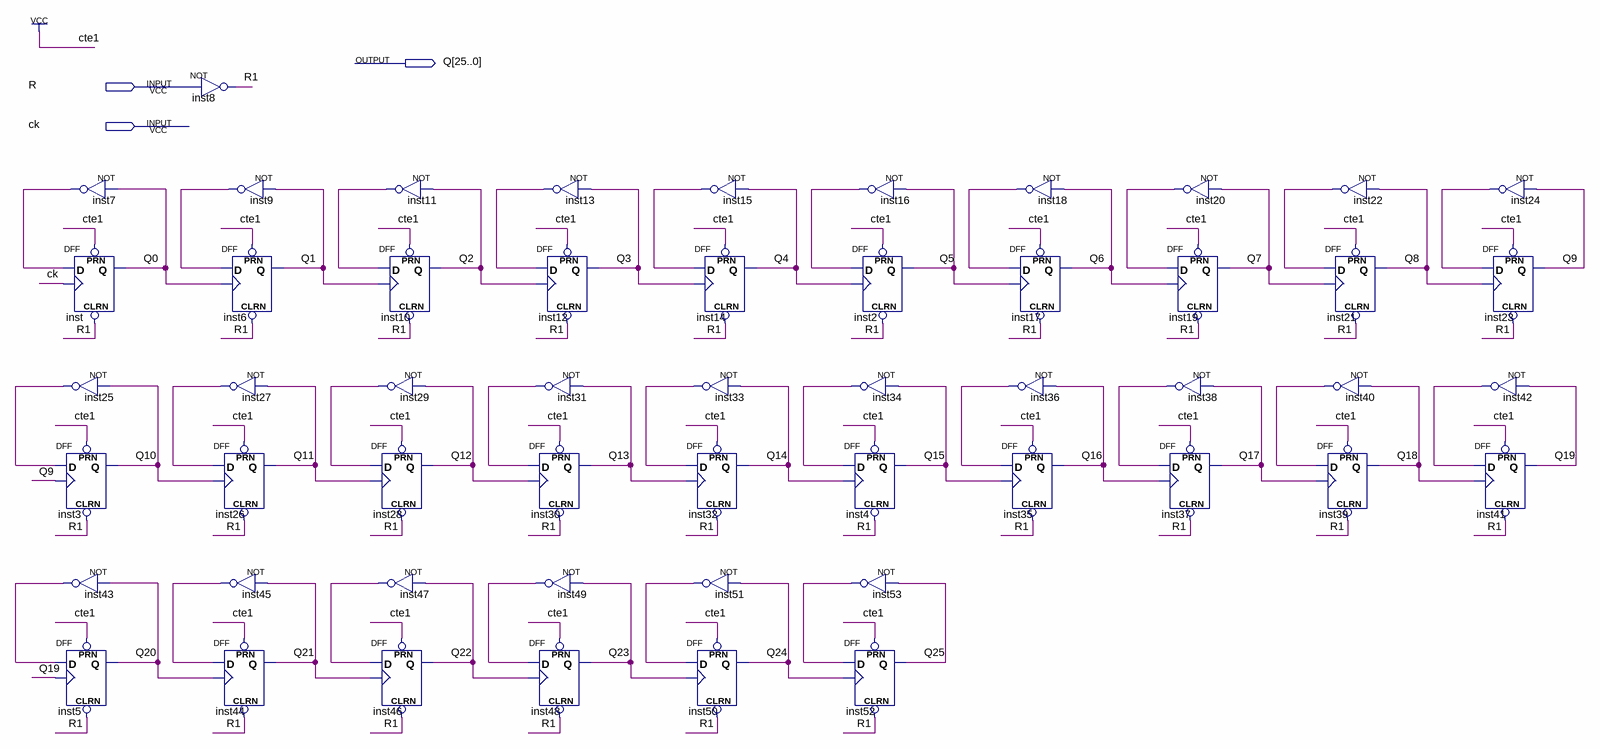
[diagram p0: schematic sheet]
// Quartus schematic DivFreq.bdf as structural Verilog: 53 symbols, 3 pins
module DivFreq (
  input  R,
  input  ck,
  output [25:0] Q
);

  wire inst7_out, inst9_out, inst11_out, inst13_out, inst15_out, inst16_out, inst18_out, inst20_out,
       inst22_out, inst24_out, inst25_out, inst27_out, inst29_out, inst31_out, inst33_out, inst34_out,
       inst36_out, inst38_out, inst40_out, inst42_out, inst43_out, inst45_out, inst47_out, inst49_out,
       inst51_out, inst53_out, R1;

  not inst7 (inst7_out, Q[0]);
  DFF inst (.CLRN(R1), .CLK(ck), .D(inst7_out), .PRN(1'b1), .Q(Q[0]));
  not inst25 (inst25_out, Q[10]);
  DFF inst3 (.CLRN(R1), .CLK(Q[9]), .D(inst25_out), .PRN(1'b1), .Q(Q[10]));
  not inst43 (inst43_out, Q[20]);
  DFF inst5 (.CLRN(R1), .CLK(Q[19]), .D(inst43_out), .PRN(1'b1), .Q(Q[20]));
  not inst8 (R1, R);
  not inst9 (inst9_out, Q[1]);
  DFF inst6 (.CLRN(R1), .CLK(Q[0]), .D(inst9_out), .PRN(1'b1), .Q(Q[1]));
  not inst27 (inst27_out, Q[11]);
  DFF inst26 (.CLRN(R1), .CLK(Q[10]), .D(inst27_out), .PRN(1'b1), .Q(Q[11]));
  not inst45 (inst45_out, Q[21]);
  DFF inst44 (.CLRN(R1), .CLK(Q[20]), .D(inst45_out), .PRN(1'b1), .Q(Q[21]));
  not inst11 (inst11_out, Q[2]);
  DFF inst10 (.CLRN(R1), .CLK(Q[1]), .D(inst11_out), .PRN(1'b1), .Q(Q[2]));
  not inst29 (inst29_out, Q[12]);
  DFF inst28 (.CLRN(R1), .CLK(Q[11]), .D(inst29_out), .PRN(1'b1), .Q(Q[12]));
  not inst47 (inst47_out, Q[22]);
  DFF inst46 (.CLRN(R1), .CLK(Q[21]), .D(inst47_out), .PRN(1'b1), .Q(Q[22]));
  not inst13 (inst13_out, Q[3]);
  DFF inst12 (.CLRN(R1), .CLK(Q[2]), .D(inst13_out), .PRN(1'b1), .Q(Q[3]));
  not inst31 (inst31_out, Q[13]);
  DFF inst30 (.CLRN(R1), .CLK(Q[12]), .D(inst31_out), .PRN(1'b1), .Q(Q[13]));
  not inst49 (inst49_out, Q[23]);
  DFF inst48 (.CLRN(R1), .CLK(Q[22]), .D(inst49_out), .PRN(1'b1), .Q(Q[23]));
  not inst15 (inst15_out, Q[4]);
  DFF inst14 (.CLRN(R1), .CLK(Q[3]), .D(inst15_out), .PRN(1'b1), .Q(Q[4]));
  not inst33 (inst33_out, Q[14]);
  DFF inst32 (.CLRN(R1), .CLK(Q[13]), .D(inst33_out), .PRN(1'b1), .Q(Q[14]));
  not inst51 (inst51_out, Q[24]);
  DFF inst50 (.CLRN(R1), .CLK(Q[23]), .D(inst51_out), .PRN(1'b1), .Q(Q[24]));
  not inst16 (inst16_out, Q[5]);
  DFF inst2 (.CLRN(R1), .CLK(Q[4]), .D(inst16_out), .PRN(1'b1), .Q(Q[5]));
  not inst34 (inst34_out, Q[15]);
  DFF inst4 (.CLRN(R1), .CLK(Q[14]), .D(inst34_out), .PRN(1'b1), .Q(Q[15]));
  not inst53 (inst53_out, Q[25]);
  DFF inst52 (.CLRN(R1), .CLK(Q[24]), .D(inst53_out), .PRN(1'b1), .Q(Q[25]));
  not inst18 (inst18_out, Q[6]);
  DFF inst17 (.CLRN(R1), .CLK(Q[5]), .D(inst18_out), .PRN(1'b1), .Q(Q[6]));
  not inst36 (inst36_out, Q[16]);
  DFF inst35 (.CLRN(R1), .CLK(Q[15]), .D(inst36_out), .PRN(1'b1), .Q(Q[16]));
  not inst20 (inst20_out, Q[7]);
  DFF inst19 (.CLRN(R1), .CLK(Q[6]), .D(inst20_out), .PRN(1'b1), .Q(Q[7]));
  not inst38 (inst38_out, Q[17]);
  DFF inst37 (.CLRN(R1), .CLK(Q[16]), .D(inst38_out), .PRN(1'b1), .Q(Q[17]));
  not inst22 (inst22_out, Q[8]);
  DFF inst21 (.CLRN(R1), .CLK(Q[7]), .D(inst22_out), .PRN(1'b1), .Q(Q[8]));
  not inst40 (inst40_out, Q[18]);
  DFF inst39 (.CLRN(R1), .CLK(Q[17]), .D(inst40_out), .PRN(1'b1), .Q(Q[18]));
  not inst24 (inst24_out, Q[9]);
  DFF inst23 (.CLRN(R1), .CLK(Q[8]), .D(inst24_out), .PRN(1'b1), .Q(Q[9]));
  not inst42 (inst42_out, Q[19]);
  DFF inst41 (.CLRN(R1), .CLK(Q[18]), .D(inst42_out), .PRN(1'b1), .Q(Q[19]));
endmodule
